# Altium schematic sheet Reefing-IMU.SchDoc: Reefing System
size A4; DocumentNumber: Subtitle; Revision: V1.0; SheetNumber: 11; SheetTotal: 13; Author: Luca Jost; Subtitle: Inertial Measurement Unit
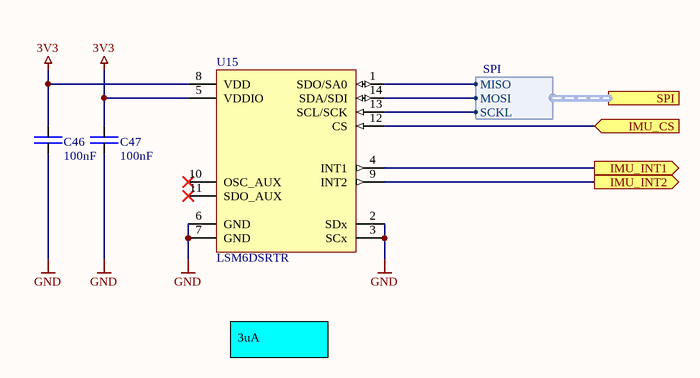
[diagram p0: Reefing-IMU.SchDoc]

## Parts
C46  100nF  [SMD Keramikkondensator 0402]
C47  100nF  [SMD Keramikkondensator 0402]
U15  LSM6DSRTR  [SMD IC LGA-14]

## Ports
IMU_CS (in), IMU_INT1 (out), IMU_INT2 (out), SPI (harness SPI)

## Harnesses
SPI: SCKL, MOSI, MISO

## Nets
3V3: C46.2 C47.2 U15.5(VDDIO) U15.8(VDD)
GND: C46.1 C47.1 U15.2(SDx) U15.3(SCx) U15.6(GND) U15.7(GND)
IMU_CS: U15.12(CS) ; port IMU_CS
IMU_INT1: U15.4(INT1) ; port IMU_INT1
IMU_INT2: U15.9(INT2) ; port IMU_INT2
NetU15_1: U15.1(SDO/SA0) ; port SPI.MISO
NetU15_13: U15.13(SCL/SCK) ; port SPI.SCKL
NetU15_14: U15.14(SDA/SDI) ; port SPI.MOSI

Not connected (* = marked no-connect by the designer): U15 10(OSC_AUX)* 11(SDO_AUX)*

## Notes on the sheet
- 3uA
- Title
- Author:
- Subtitle
- Date:
- Rev:
- File:
- Sheet
- of

## Library data of the parts
C46 C47 = E6 - 100nF: SMD Ceramic Capacitor E6; Unit Price: 0.01; JLC: C307331
U15 = LSM6DSRTR: Accelerometer, Gyroscope, Temperature, 6 Axis Sensor I²C, SPI Output; ComponentLink1Description: Datasheet; ComponentLink1URL: https://datasheet.lcsc.com/lcsc/2201131130_STMicroelectronics-LSM6DSRTR_C784817.pdf; JLC: C784817; Unit Price: 4.88